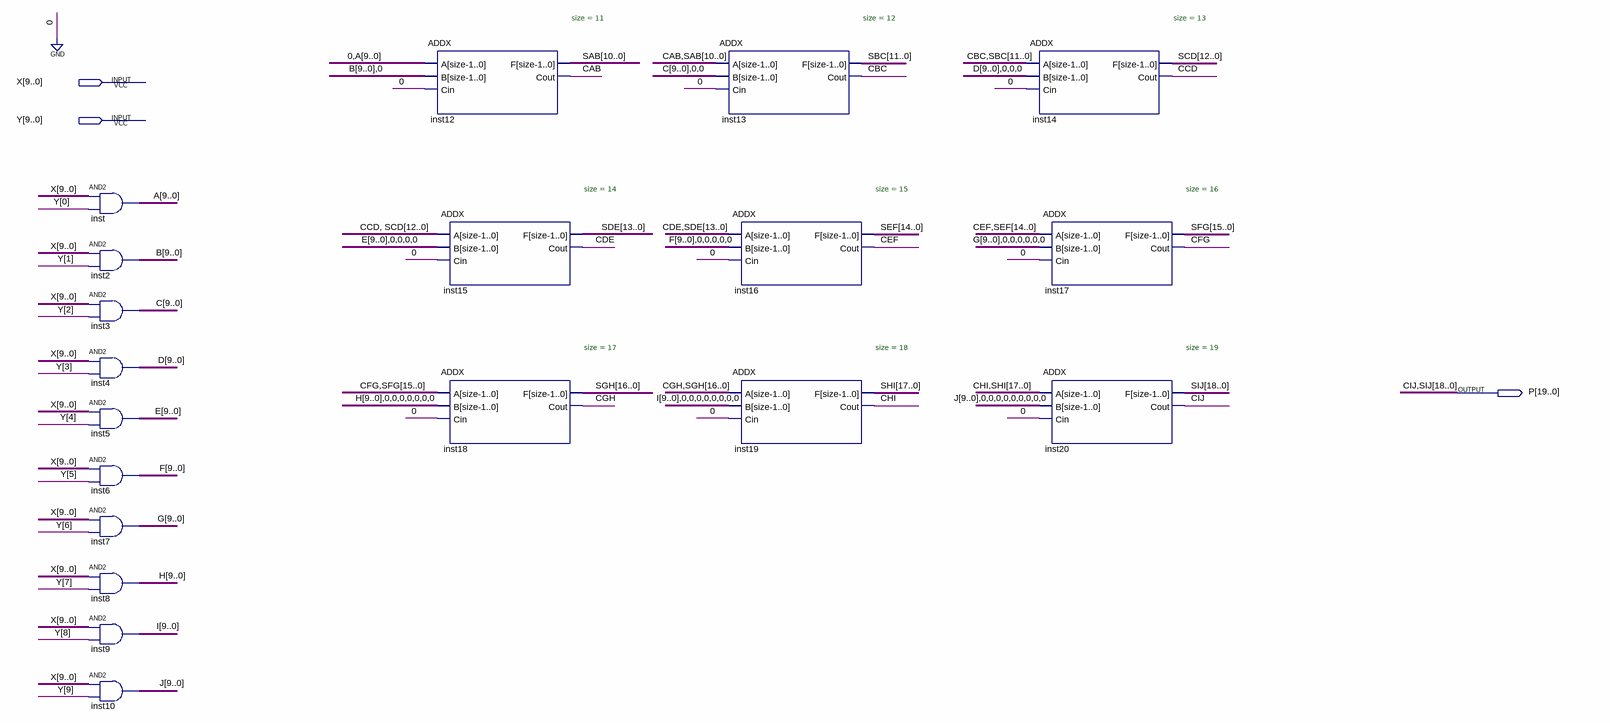
[diagram p0: schematic sheet]
// Quartus schematic MUL.bdf as structural Verilog: 19 symbols, 3 pins
module MUL (
  input  [9:0] X,
  input  [9:0] Y,
  output [19:0] P
);

  wire CAB, CBC, CCD, CDE, CEF, CFG, CGH, CHI;
  wire [9:0] A, B, C, D, E, F, G, H, I, J;
  wire [10:0] SAB;
  wire [11:0] SBC;
  wire [12:0] SCD;
  wire [13:0] SDE;
  wire [14:0] SEF;
  wire [15:0] SFG;
  wire [16:0] SGH;
  wire [17:0] SHI;

  assign A = X & {10{Y[0]}};  // AND2 inst, 10 bits wide
  assign B = X & {10{Y[1]}};  // AND2 inst2, 10 bits wide
  assign C = X & {10{Y[2]}};  // AND2 inst3, 10 bits wide
  assign D = X & {10{Y[3]}};  // AND2 inst4, 10 bits wide
  assign E = X & {10{Y[4]}};  // AND2 inst5, 10 bits wide
  assign F = X & {10{Y[5]}};  // AND2 inst6, 10 bits wide
  assign G = X & {10{Y[6]}};  // AND2 inst7, 10 bits wide
  assign H = X & {10{Y[7]}};  // AND2 inst8, 10 bits wide
  assign I = X & {10{Y[8]}};  // AND2 inst9, 10 bits wide
  assign J = X & {10{Y[9]}};  // AND2 inst10, 10 bits wide
  ADDX #(.size(11)) inst12 (.A({1'b0, A}), .B({B, 1'b0}), .Cin(1'b0), .F(SAB), .Cout(CAB));
  ADDX #(.size(14)) inst15 (.A({CCD, SCD}), .B({E, 4'b0000}), .Cin(1'b0), .F(SDE), .Cout(CDE));
  ADDX #(.size(17)) inst18 (.A({CFG, SFG}), .B({H, {7{1'b0}}}), .Cin(1'b0), .F(SGH), .Cout(CGH));
  ADDX #(.size(12)) inst13 (.A({CAB, SAB}), .B({C, 2'b00}), .Cin(1'b0), .F(SBC), .Cout(CBC));
  ADDX #(.size(15)) inst16 (.A({CDE, SDE}), .B({F, {5{1'b0}}}), .Cin(1'b0), .F(SEF), .Cout(CEF));
  ADDX #(.size(18)) inst19 (.A({CGH, SGH}), .B({I, {8{1'b0}}}), .Cin(1'b0), .F(SHI), .Cout(CHI));
  ADDX #(.size(13)) inst14 (.A({CBC, SBC}), .B({D, 3'b000}), .Cin(1'b0), .F(SCD), .Cout(CCD));
  ADDX #(.size(16)) inst17 (.A({CEF, SEF}), .B({G, {6{1'b0}}}), .Cin(1'b0), .F(SFG), .Cout(CFG));
  ADDX #(.size(19)) inst20 (.A({CHI, SHI}), .B({J, {9{1'b0}}}), .Cin(1'b0), .F(P[18:0]), .Cout(P[19]));

  // Other names for the same wires on the sheet: CIJ = P[19]; SIJ[18:0] = P[18:0]
endmodule
